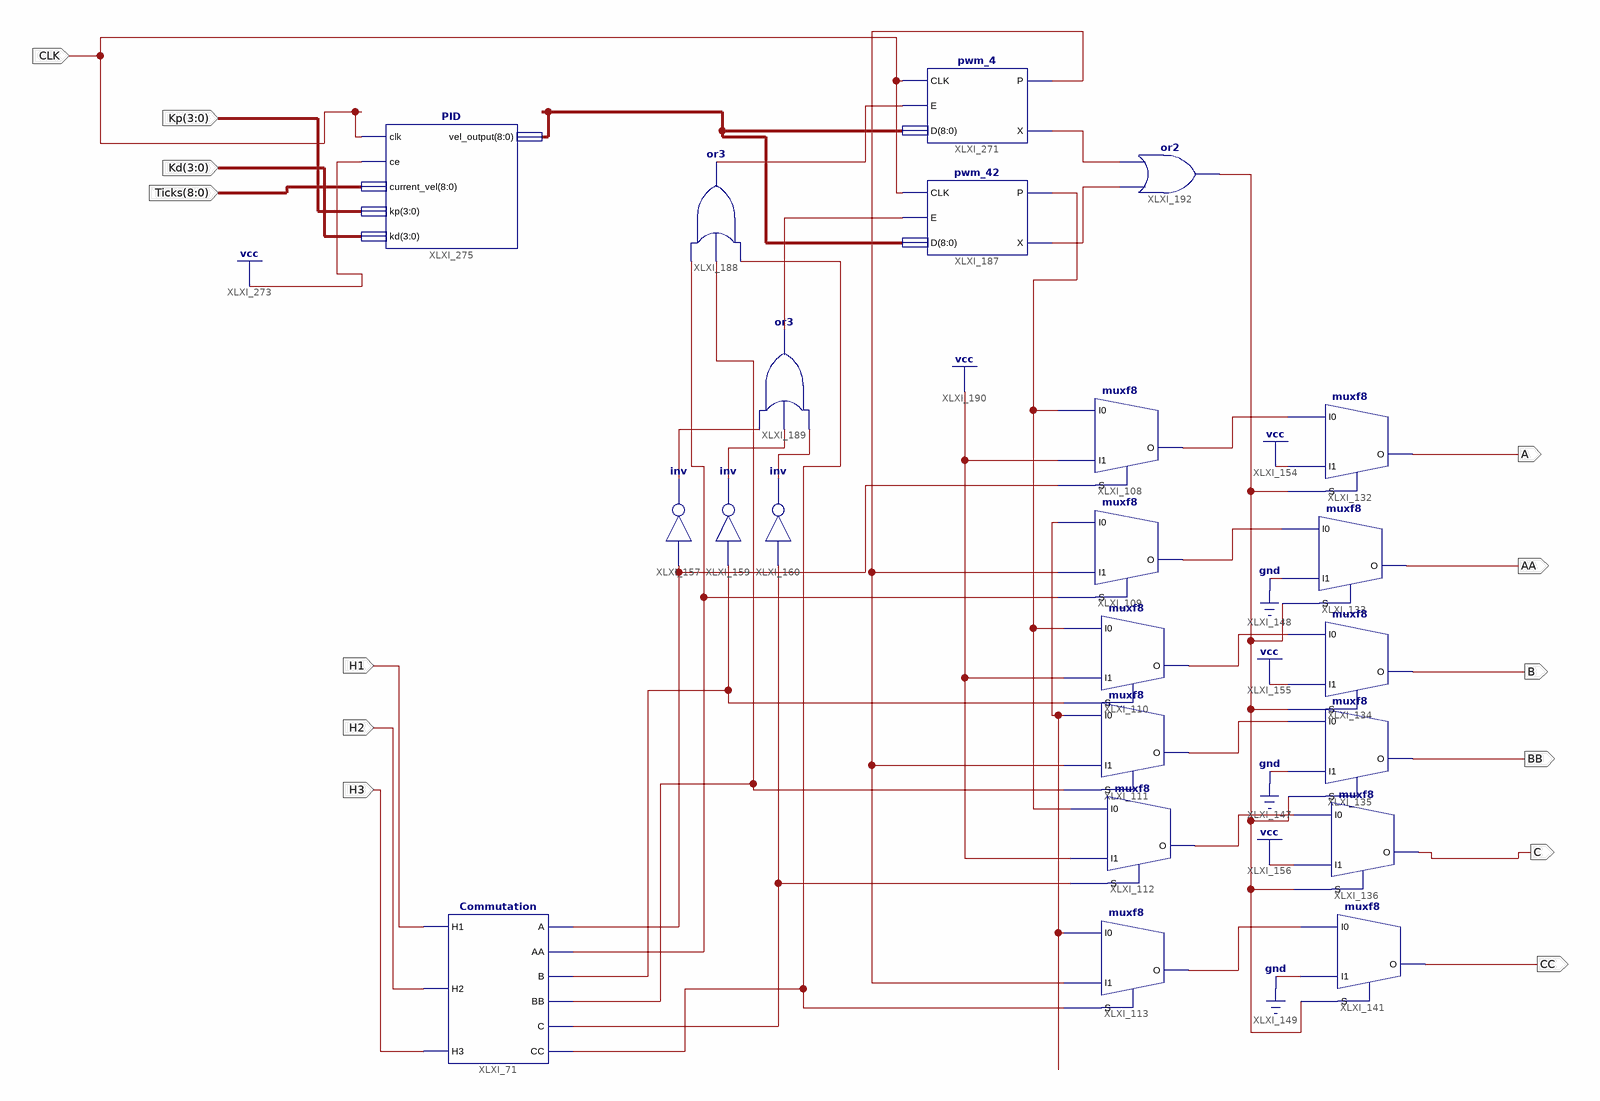
[diagram p0: schematic sheet 1]
// Xilinx ISE schematic MAIN_1.sch (spartan3e) as structural Verilog: 22 symbols, 13 ports
module MAIN_1 (
  input  H3,
  input  H2,
  input  H1,
  input  CLK,
  input  [3:0] Kp,
  input  [3:0] Kd,
  input  [8:0] Ticks,
  output A,
  output AA,
  output B,
  output BB,
  output C,
  output CC
);

  wire XLXN_167, XLXN_168, XLXN_169, XLXN_171, XLXN_216, XLXN_267, XLXN_268, XLXN_269, XLXN_270, XLXN_271,
       XLXN_272, XLXN_288, XLXN_289, XLXN_335, XLXN_336, XLXN_337, XLXN_338, XLXN_347, XLXN_352, XLXN_361,
       XLXN_362, XLXN_363, XLXN_364;
  wire [8:0] XLXN_372;

  muxf8 XLXI_108 (.I0(XLXN_347), .I1(1'b1), .S(XLXN_167), .O(XLXN_267));
  muxf8 XLXI_109 (.I0(XLXN_361), .I1(XLXN_352), .S(XLXN_168), .O(XLXN_268));
  muxf8 XLXI_110 (.I0(XLXN_347), .I1(1'b1), .S(XLXN_169), .O(XLXN_269));
  muxf8 XLXI_111 (.I0(XLXN_361), .I1(XLXN_352), .S(XLXN_337), .O(XLXN_270));
  muxf8 XLXI_112 (.I0(XLXN_347), .I1(1'b1), .S(XLXN_171), .O(XLXN_271));
  muxf8 XLXI_113 (.I0(XLXN_361), .I1(XLXN_352), .S(XLXN_338), .O(XLXN_272));
  muxf8 XLXI_132 (.I0(XLXN_267), .I1(1'b1), .S(XLXN_364), .O(A));
  muxf8 XLXI_133 (.I0(XLXN_268), .I1(1'b0), .S(XLXN_364), .O(AA));
  muxf8 XLXI_134 (.I0(XLXN_269), .I1(1'b1), .S(XLXN_364), .O(B));
  muxf8 XLXI_135 (.I0(XLXN_270), .I1(1'b0), .S(XLXN_364), .O(BB));
  muxf8 XLXI_136 (.I0(XLXN_271), .I1(1'b1), .S(XLXN_364), .O(C));
  muxf8 XLXI_141 (.I0(XLXN_272), .I1(1'b0), .S(XLXN_364), .O(CC));
  Commutation XLXI_71 (
    .H1(H1), .H2(H2), .H3(H3), .A(XLXN_167), .AA(XLXN_168), .B(XLXN_169), .BB(XLXN_337), .C(XLXN_171),
    .CC(XLXN_338));
  not XLXI_157 (XLXN_336, XLXN_167);
  not XLXI_159 (XLXN_288, XLXN_169);
  not XLXI_160 (XLXN_289, XLXN_171);
  or XLXI_188 (XLXN_216, XLXN_338, XLXN_337, XLXN_168);
  or XLXI_189 (XLXN_335, XLXN_289, XLXN_288, XLXN_336);
  pwm_42 XLXI_187 (.CLK(CLK), .E(XLXN_335), .D(XLXN_372), .P(XLXN_347), .X(XLXN_363));
  or XLXI_192 (XLXN_364, XLXN_363, XLXN_362);
  pwm_4 XLXI_271 (.CLK(CLK), .E(XLXN_216), .D(XLXN_372), .P(XLXN_352), .X(XLXN_362));
  PID XLXI_275 (.clk(CLK), .ce(1'b1), .current_vel(Ticks), .kp(Kp), .kd(Kd), .vel_output(XLXN_372));
endmodule
